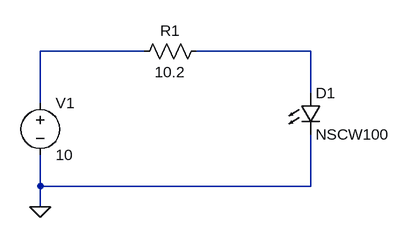
[diagram p0: schematic formatted_circuit.asc]
formatted_circuit.asc, the LTspice schematic file:
Version 4
SHEET 1 880 680
WIRE 352 16 192 16
WIRE 608 16 432 16
WIRE 608 80 608 16
WIRE 192 96 192 16
WIRE 192 224 192 176
WIRE 608 224 608 144
WIRE 608 224 192 224
WIRE 192 256 192 224
FLAG 192 256 0
SYMBOL voltage 192 80 R0
WINDOW 123 0 0 Left 0
WINDOW 39 0 0 Left 0
SYMATTR InstName V1
SYMATTR Value 10
SYMBOL res 448 0 R90
WINDOW 0 0 56 VBottom 2
WINDOW 3 32 56 VTop 2
SYMATTR InstName R1
SYMATTR Value 10.2
SYMATTR SpiceLine tol=1 pwr=0.1
SYMBOL LED 592 80 R0
SYMATTR InstName D1
SYMATTR Value NSCW100

The netlist it stands for:
* formatted_circuit.asc
V1 N001 0 10
R1 N002 N001 10.2 tol=1 pwr=0.1
D1 N002 0 NSCW100
.model D D
.lib standard.dio
.backanno
.end